# Altium project FM Transmitter.PrjPcb
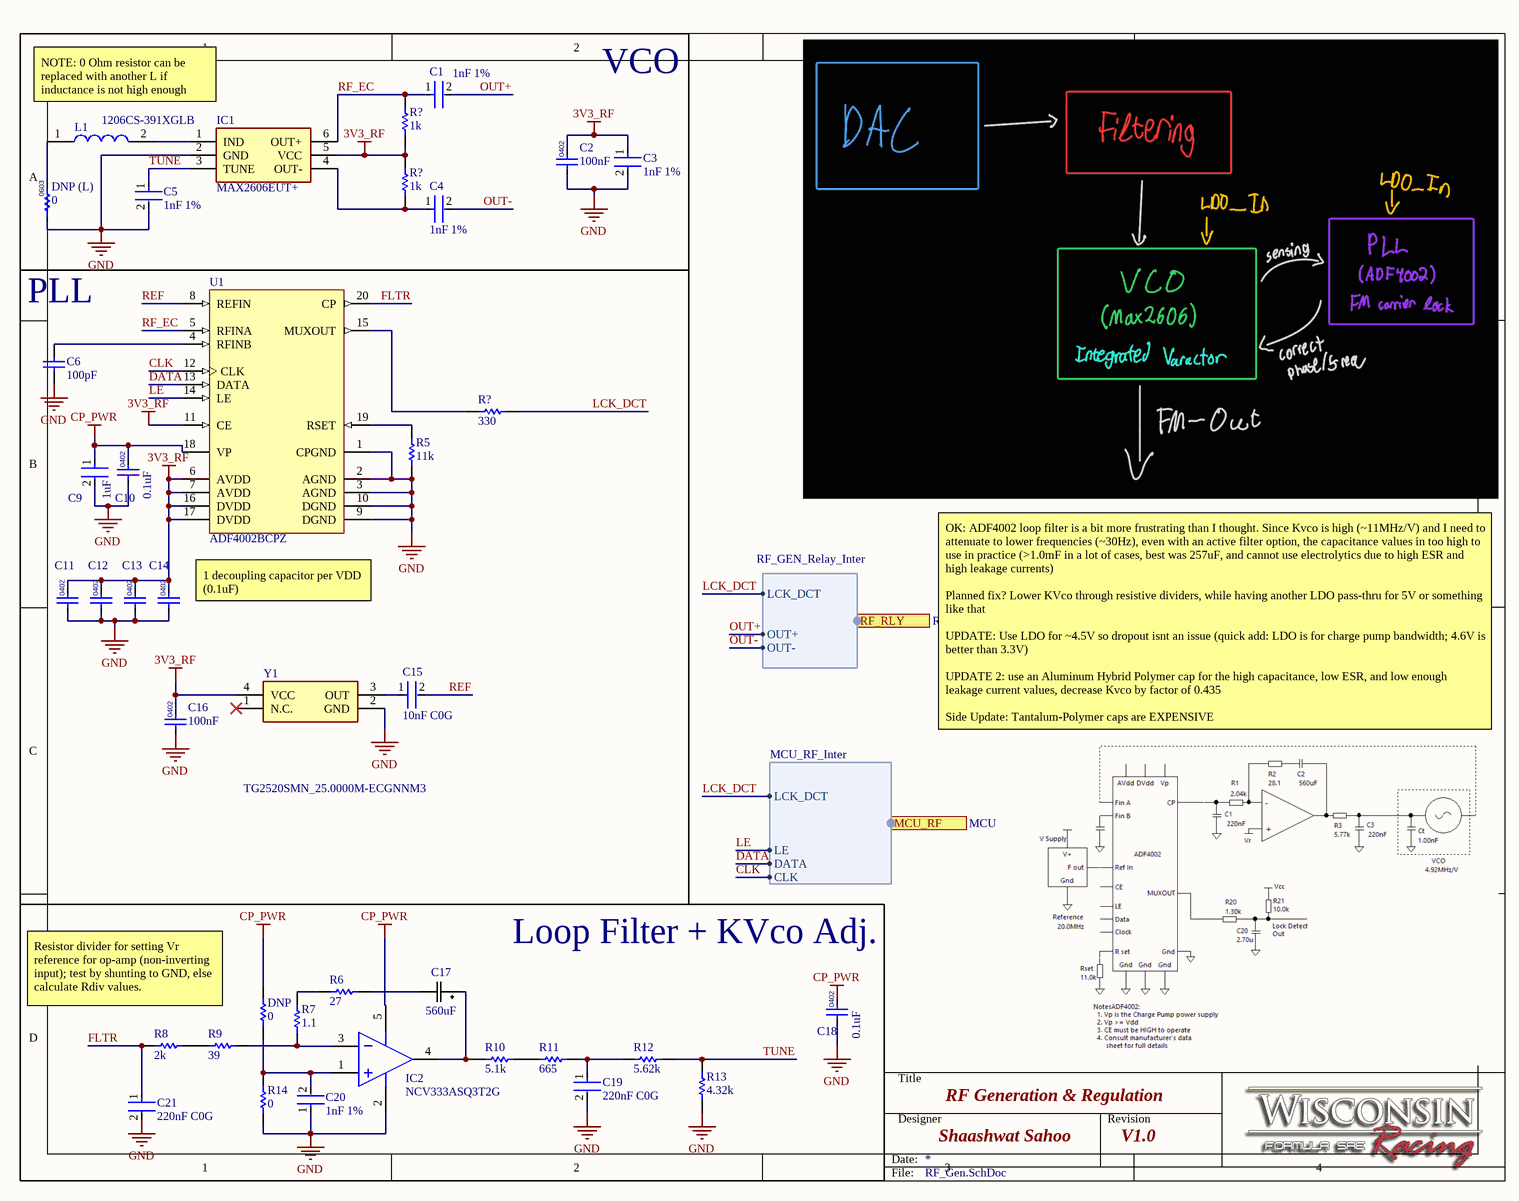
[diagram p0: RF_Gen.SchDoc]
6 sheets, 132 parts. Net scope: flat (ports and power ports of the same name join across sheets).
Sheets:
  RF_Gen.SchDoc
  PDU.SchDoc
  BM83.SchDoc
  DAC.SchDoc
  MCU.SchDoc
  RF_Bypass.SchDoc

## Sheet RF_Gen.SchDoc: RF Generation & Regulation
size 279 x 215 mm; Engineer: Shaashwat Sahoo; Revision: V1.0; SheetNumber: 1; SheetTotal: 6; SPICEModelCacheMXYIGOMC: <root> / <DocumentId>MXYIGOMC</DocumentId> / <CacheFrame Number="0"> / <Model Name="cap" Kind="MDL"> / <Text>*Default semiconductor capacitor / .MODEL CAP C()</Text> / </Model> / </CacheFrame> / </root>

### Parts
(Parts that share a designator on the sheet are numbered #1, #2 ... from top to bottom, then left to right.)
C1  1nF 1%  [FP-GRT155-0_05-IPC_A]
C2  100nF  [FP-CC0402-IPC_B]
C3  1nF 1%  [FP-GRT155-0_05-IPC_A]
C4  1nF 1%  [FP-GRT155-0_05-IPC_A]
C5  1nF 1%  [FP-GRT155-0_05-IPC_A]
C6  100pF  [CAPC1005X55X25ML05T10]
C9  1uF  [FP-GRM155-0_1-IPC_A]
C10  0.1uF  [FP-CC0402-IPC_B]
C11  0.1uF  [FP-CC0402-IPC_B]  (value not drawn)
C12  0.1uF  [FP-CC0402-IPC_B]  (value not drawn)
C13  0.1uF  [FP-CC0402-IPC_B]  (value not drawn)
C14  0.1uF  [FP-CC0402-IPC_B]  (value not drawn)
C15  10nF C0G  [FP-GRM155-0_15-MFG]
C16  100nF  [FP-CC0402-IPC_B]
C17  560uF  [CAP_GY_10X10_NCH]
C18  0.1uF  [FP-CC0402-IPC_B]
C19  220nF C0G  [FP-GRM31C-0_2-e0_3_0_8-IPC_B]
C20  1nF 1%  [FP-GRT155-0_05-IPC_A]
C21  220nF C0G  [FP-GRM31C-0_2-e0_3_0_8-IPC_B]
DNP#1  0  [RESC1005X40X25NL05T10]
DNP_(L)  0  [Res0603-type-2]
IC1  MAX2606EUT+  [SOT95P280X145-6N]
IC2  NCV333ASQ3T2G  [SOT65P210X110-5N]
L1  1206CS-391XGLB  [INDC3622X152N]
R5  11k  [RESC1005X40X25NL05T10]
R6  27  [RESC1005X40X25LL05T10]
R7  1.1  [RESC1005X40X25NL05T10]
R8  2k  [RESC1005X35X25NL10T10]
R9  39  [RESC1005X40X25LL05T10]
R10  5.1k  [RESC1005X40X25NL05T10]
R11  665  [RESC1005X40X25ML05T10]
R12  5.62k  [RESC1005X40X25LL05T10]
R13  4.32k  [RESC1005X40X25NL05T10]
R14  0  [RESC1005X40X25NL05T10]
R?#1  1k  [RESC1005X40X25LL05T10]
R?#2  1k  [RESC1005X40X25LL05T10]
R?#3  330  [RESC1005X40X25LL05T10]
U1  ADF4002BCPZ  [ADI-CP-20-1_M]
Y1  TG2520SMN_25.0000M-ECGNNM3  [TG2520SMN250000MECGNNM3]

### Blocks framed on the sheet
VCO: C1-C5 DNP_(L) IC1 L1 R?#1 R?#2
PLL: C6 C9-C16 R5 R?#3 U1 Y1
Loop Filter + KVco Adj.: C17-C21 DNP#1 IC2 R6-R14

### Ports
MCU_RF (harness MCU_RF_Inter, see MCU), RF_RLY (harness RF_GEN_Relay_Inter, see RF_Bypass)

### Harnesses
MCU_RF_Inter: LCK_DCT, LE, DATA, CLK
RF_GEN_Relay_Inter: LCK_DCT, OUT+, OUT-

### Nets
3V3_RF: C2.2 C3.1 C11.2 C12.2 C13.2 C14.2 C16.2 IC1.5(VCC) R?#1.1 R?#2.2 U1.6(AVDD) U1.7(AVDD) U1.11(CE) U1.16(DVDD) U1.17(DVDD) Y1.4(VCC)
CP_PWR: C9.1 C10.2 C18.2 DNP#1.2 IC2.5(V-) U1.18(VP)
GND: C2.1 C3.2 C5.2 C6.2 C9.2 C10.1 C11.1 C12.1 C13.1 C14.1 C16.1 C18.1 C19.2 C20.1 C21.2 DNP_(L).1 IC1.2(GND) IC2.2(V-) R5.1 R13.1 R14.1 U1.1(CPGND) U1.2(AGND) U1.3(AGND) U1.9(DGND) U1.10(DGND) Y1.2(GND)
CLK: U1.12(CLK) ; port MCU_RF.CLK
DATA: U1.13(DATA) ; port MCU_RF.DATA
FLTR: C21.1 R8.1 U1.20(CP)
LCK_DCT: R?#3.2 ; port MCU_RF.LCK_DCT, port RF_RLY.LCK_DCT
LE: U1.14(LE) ; port MCU_RF.LE
OUT+: C1.2 ; port RF_RLY.OUT+
OUT-: C4.2 ; port RF_RLY.OUT-
REF: C15.2 U1.8(REFIN)
RF_EC: C1.1 IC1.6(OUT+) R?#1.2 U1.5(RFINA)
TUNE: C5.1 IC1.3(TUNE) R12.2 R13.2
NetC4_1: C4.1 IC1.4(OUT-) R?#2.1
NetC6_1: C6.1 U1.4(RFINB)
NetC15_1: C15.1 Y1.3(OUT)
NetC17_1: C17.1 IC2.4(OUT) R10.1
NetC17_2: C17.2 R6.2
NetC19_1: C19.1 R11.2 R12.1
NetC20_2: C20.2 DNP#1.1 IC2.1(IN+) R14.2
NetDNP_(L)_2: DNP_(L).2 L1.1
NetIC1_1: IC1.1(IND) L1.2
NetIC2_3: IC2.3(IN-) R7.1 R9.2
NetR5_2: R5.2 U1.19(RSET)
NetR6_1: R6.1 R7.2
NetR8_2: R8.2 R9.1
NetR10_2: R10.2 R11.1
NetR?#3_1: R?#3.1 U1.15(MUXOUT)

Not connected (* = marked no-connect by the designer): Y1 1(N.C.)*

### Notes on the sheet
- NOTE: 0 Ohm resistor can be replaced with another L if inductance is not high enough
- 1 decoupling capacitor per VDD (0.1uF)
- OK: ADF4002 loop filter is a bit more frustrating than I thought. Since Kvco is high (~11MHz/V) and I need to attenuate to lower frequencies (~30Hz), even with an active filter option, the capacitance values in too high to use in practice (>1.0mF in a lot of cases, best was 257uF, and cannot use electrolytics due to high ESR and high leakage currents)
  Planned fix? Lower KVco through resistive dividers, while having another LDO pass-thru for 5V or something like that
  UPDATE: Use LDO for ~4.5V so dropout isnt an issue (quick add: LDO is for charge pump bandwidth; 4.6V is better than 3.3V)
  UPDATE 2: use an Aluminum Hybrid Polymer cap for the high capacitance, low ESR, and low enough leakage current values, decrease Kvco by factor of 0.435
  Side Update: Tantalum-Polymer caps are EXPENSIVE
- Resistor divider for setting Vr reference for op-amp (non-inverting input); test by shunting to GND, else calculate Rdiv values.
- Title
- Designer
- Revision
- Date:
- File:
- (in symbol CMP-Cap-00006-1) 0402
- (in symbol CMP-Res-00022-2) 0603

### Library data of the parts
C1 C3-C5 C20 = CMP-06035-012909-1: Multi-Layer Ceramic Capacitor 1nF 50V C0G ±1% 0402 Paper T/R / GRT1555C1H102FA02D
C2 C16 = CMP-Cap-00006-1: Ceramic Capacitor, Multilayer, Ceramic, 16V, 10% +Tol, 10% -Tol, X7R, 15% TC, 0.1uF, Surface Mount, 0402; Dielectric: XR7; Tolerance: 10%; Capacitance: 100nF; Voltage Rating: 16V
C6 = CMP-2008-03915-1: Manufacturer: Murata; Part Number: GRM1555C1H101JA01D
C9 = CMP-06035-012596-1: Chip Multilayer Ceramic Capacitors for General Purpose, 0402, 1.0uF, X7R, 15%, 10%, 10V
C10-C14 C18 = CMP-Cap-00006-1: Ceramic Capacitor, Multilayer, Ceramic, 16V, 10% +Tol, 10% -Tol, X7R, 15% TC, 0.1uF, Surface Mount, 0402; Dielectric: XR7; Capacitance: 100nF; Tolerance: 10%; Voltage Rating: 16V
C15 = CMP-06035-053372-1: Chip Multilayer Ceramic Capacitors for General Purpose, 0402, 10000pF, C0G, 30ppm/°C, 5%, 35V
C17 = CMP-034-000012-1: Description; Manufacturer_Name: Nichicon; Copyright: Copyright (C) 2025 Ultra Librarian. All rights reserved.; Design Item ID: GYB1J560MCQ1GS; Manufacturer_Part_Number: GYB1J560MCQ1GS; Source: GYB1J560MCQ1GS.SchLib
C19 C21 = CMP-06035-005862-1: Chip Multilayer Ceramic Capacitors for General Purpose, 1206, 0.22uF, C0G, 30ppm/°C, 5%, 25V
DNP#1 R14 = CMP-1011-00001-2: Manufacturer: Yageo / Phycomp; Part Number: RC0402JR-070RL
DNP_(L) = CMP-Res-00022-2: Fixed Resistor, Metal Glaze/thick Film, 0.1W, 0ohm, Surface Mount, 0603; Tolerance: 0.1%; Power: 100mW; Resistance: 0
IC1 = MAX2606EUT+: Integrated Circuit; Manufacturer_Name: Analog Devices; Datasheet Link: https://datasheets.maximintegrated.com/en/ds/MAX2605-MAX2609.pdf; Height: 1.45mm; Manufacturer_Part_Number: MAX2606EUT+; Mouser Part Number: 700-MAX2606EUT+; Mouser Price/Stock: https://www.mouser.co.uk/ProductDetail/Analog-Devices-Maxim-Integrated/MAX2606EUT%2b?qs=U8%2FOE6X5Fv%2F2oJ3nHVn6vA%3D%3D
IC2 = CMP-006-000098-2: Low Offset Voltage: 10 V max (NCS333); Manufacturer_Name: onsemi; Design Item ID: NCV333ASQ3T2G; Manufacturer_Part_Number: NCV333ASQ3T2G; Source: SamacSys.SchLib; Datasheet Link: https://www.onsemi.com/pub/Collateral/NCS333-D.PDF; Height: 1.1mm; Arrow Part Number: NCV333ASQ3T2G; Arrow Price/Stock: https://www.arrow.com/en/products/ncv333asq3t2g/on-semiconductor?region=nac; Mouser Part Number: 863-NCV333ASQ3T2G; Mouser Price/Stock: https://www.mouser.co.uk/ProductDetail/onsemi/NCV333ASQ3T2G?qs=f9yNj16SXrKU9Ty3EUv2qA%3D%3D
L1 = 1206CS-391XGLB: Inductor; Manufacturer_Name: COILCRAFT; Datasheet Link: https://componentsearchengine.com/Datasheets/2/1206CS-391XGLB.pdf; Height: 1.52mm; Manufacturer_Part_Number: 1206CS-391XGLB
R5 R10 = CMP-2002-07753-1: Part Number: RC0402FR-075K1L; Manufacturer: Yageo / Phycomp
R6 = CMP-2002-07055-1: Part Number: RC0402FR-0727RL; Manufacturer: Yageo / Phycomp
R7 = CMP-1011-00175-2: Part Number: RC0402FR-071R1L; Manufacturer: Yageo / Phycomp
R8 = CMP-2002-02941-1: Manufacturer: Yageo; Part Number: RT0402BRD072KL
R9 = CMP-1011-00350-2: Manufacturer: Yageo / Phycomp; Part Number: RC0402FR-0739RL
R11 = CMP-2002-07113-1: Part Number: RC0402FR-07665RL; Manufacturer: Yageo / Phycomp
R12 = CMP-2002-07755-1: Part Number: RC0402FR-075K62L; Manufacturer: Yageo / Phycomp
R13 = CMP-1011-00582-2: Part Number: RC0402FR-074K32L; Manufacturer: Yageo / Phycomp
R?#1 R?#2 = CMP-2002-07941-1: Part Number: RC0402JR-071KL; Manufacturer: Yageo / Phycomp
R?#3 = CMP-2002-07613-1: Part Number: RC0402FR-07330RL; Manufacturer: Yageo / Phycomp
U1 = CMP-0287-00012-1: Phase Detector/Frequency Synthesizer, CP-20-1, Pb-Free, 490 Tray; Max REFin (MHz): 300MHz; Supply Current: 5mA; Norm Phase Noise (dBc/Hz): -222dBc; Max RF Input (MHz): 400MHz; Frequency Range: 5MHz-400MHz; Single/Dual: Single; PackageReference: CP-20-1; Code_JEDEC: MO-220-VGGD-1; ComponentLink1URL: www.analog.com; ComponentLink3Description: Package Specification; PackageVersion: 012508-B; DatasheetVersion: Rev. B; ComponentLink3URL: http://www.analog.com/static/imported-files/packages/PKG_PDF/LFCSP(CP)/CP_20_1.pdf; ComponentLink2Description: Datasheet; ComponentLink1Description: Manufacturer URL; PackageDescription: 20-Lead Lead Frame Chip Scale Package [LFCSP_VQ]; ComponentLink2URL: http://www.analog.com/static/imported-files/data_sheets/ADF4002.pdf
Y1 = TG2520SMN_25.0000M-ECGNNM3: Crystal or Oscillator; Manufacturer_Name: Epson Timing; Manufacturer_Part_Number: TG2520SMN 25.0000M-ECGNNM3; Datasheet Link: https://au.mouser.com/datasheet/2/137/Epson_TG2016SMN_en_1649545-1889946.pdf; Height: 0.8mm; Mouser Part Number: 732-TG252S25ECGNNM3; Mouser Price/Stock: https://www.mouser.co.uk/ProductDetail/Epson-Timing/TG2520SMN-25.0000M-ECGNNM3?qs=d0WKAl%252BL4KZiXJ1i3MlmDQ%3D%3D

## Sheet PDU.SchDoc
size 279 x 215 mm; SheetNumber: 2; SheetTotal: 5
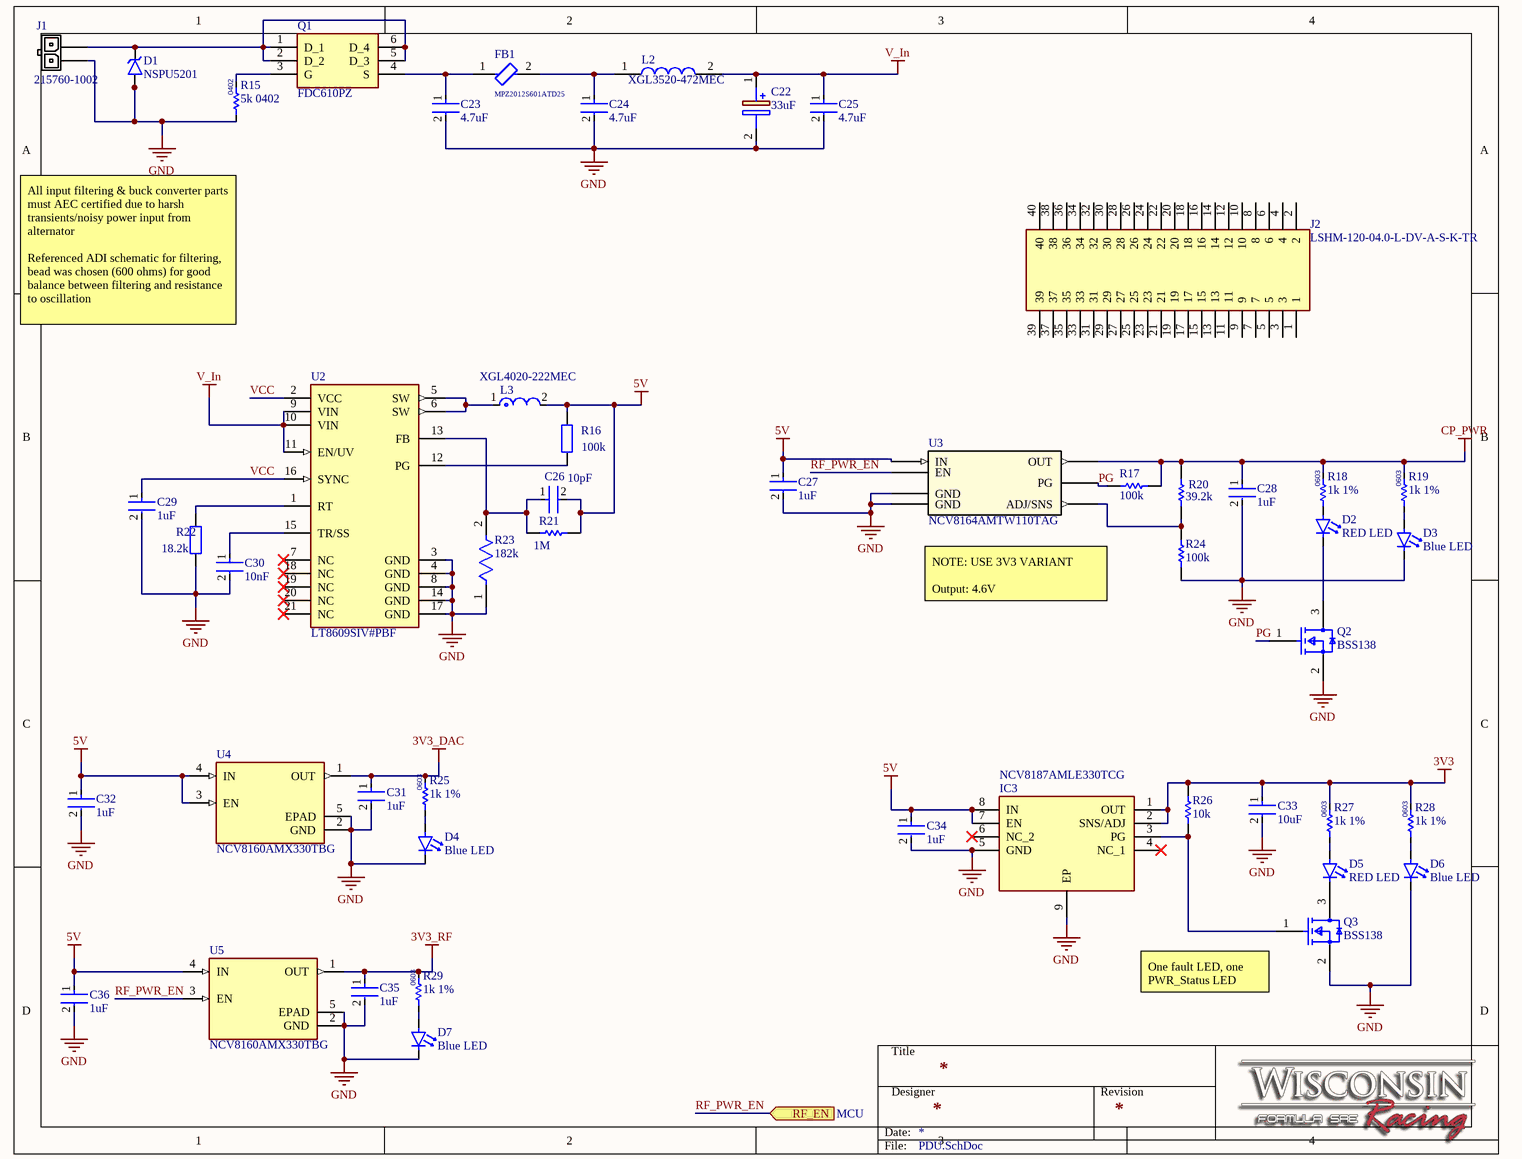
[diagram p1: PDU.SchDoc]

### Parts
C22  33uF  [MAL215097904E3]
C23  4.7uF  [FP-CGA4J-IPC_C]
C24  4.7uF  [FP-CGA4J-IPC_C]
C25  4.7uF  [FP-CGA4J-IPC_C]
C26  10pF  [FP-GCM155-0_05-IPC_C]
C27  1uF  [FP-GRM155-0_1-IPC_C]
C28  1uF  [FP-GRM155-0_1-IPC_C]
C29  1uF  [FP-GRT155-0_1-IPC_A]
C30  10nF  [FP-GCM155-0_05-IPC_C]
C31  1uF  [FP-GRM155-0_1-IPC_C]
C32  1uF  [FP-GRM155-0_1-IPC_C]
C33  10uF  [FP-GRM155-0_2-IPC_A]
C34  1uF  [FP-GRM155-0_1-IPC_C]
C35  1uF  [FP-GRM155-0_1-IPC_C]
C36  1uF  [FP-GRM155-0_1-IPC_C]
D1  NSPU5201  [NSPM5131MUTBG]
D2  RED LED  [DIOC1608X05N]
D3  Blue LED  [0603-LED-1]
D4  Blue LED  [0603-LED-1]
D5  RED LED  [DIOC1608X05N]
D6  Blue LED  [0603-LED-1]
D7  Blue LED  [0603-LED-1]
FB1  MPZ2012S601ATD25  [BEADC2012X105N]
IC3  NCV8187AMLE330TCG  [SON65P300X300X100-9N-D]
J1  215760-1002  [215760-1002-Footprint-1]
J2  LSHM-120-04.0-L-DV-A-S-K-TR  [LSHM-120-XX.X-YYY-DV-A-S-K-TR]
L2  XGL3520-472MEC  [XGL3520472MEC]
L3  XGL4020-222MEC  [FP-XGL4020-MFG]
Q1  FDC610PZ  [SOT95P280X110-6N]
Q2  BSS138  [FP-318-08-IPC_B]
Q3  BSS138  [FP-318-08-IPC_B]
R15  5k 0402  [Res0402-Type-1]
R16  100k  [WRIS-RSKS_0402]
R17  100k  [RESC1005X40X25NL05T10]
R18  1k 1%  [Res0603-type-1]
R19  1k 1%  [Res0603-type-1]
R20  39.2k  [RESC1005X40X25ML05T10]
R21  1M  [RESC1005X40X25NL05T10]
R22  18.2k  [WRIS-RSKS_0402]
R23  182k  [FP-AC0402-IPC_C]
R24  100k  [RESC1005X40X25NL05T10]
R25  1k 1%  [Res0603-type-1]
R26  10k  [RESC1005X40X25ML05T05]
R27  1k 1%  [Res0603-type-1]
R28  1k 1%  [Res0603-type-1]
R29  1k 1%  [Res0603-type-1]
U2  LT8609SIV#PBF  [FP-LQFN-16-05-08-1516-MFG]
U3  NCV8164AMTW110TAG  [WDFNW6_511DW_OSI]
U4  NCV8160AMX330TBG  [VREG_NCV8160AMX330TBG]
U5  NCV8160AMX330TBG  [VREG_NCV8160AMX330TBG]

### Ports
RF_EN (in, see MCU)

### Nets
3V3: C33.1 IC3.1(OUT) IC3.2(SNS/ADJ) R26.2 R27.2 R28.2
3V3_DAC: C31.1 R25.2 U4.1(OUT)
3V3_RF: C35.1 R29.2 U5.1(OUT)
5V: C26.2 C27.1 C32.1 C34.1 C36.1 IC3.7(EN) IC3.8(IN) L3.2 R16.2 R21.2 U3.6(IN) U4.3(EN) U4.4(IN) U5.4(IN)
CP_PWR: C28.1 R17.1 R18.2 R19.2 R20.2 U3.1(OUT)
GND: C22.2(-) C23.2 C24.2 C25.2 C27.2 C28.2 C29.2 C30.2 C31.2 C32.2 C33.2 C34.2 C35.2 C36.2 D1.5(GND_(A)_1) D1.6(GND_(A)_2) D1.7(GND_(A)_3) D1.8(GND_(A)_4) D3.1(C) D4.1(C) D6.1(C) D7.1(C) IC3.5(GND) IC3.9(EP) J1.2 Q2.2(S) Q3.2(S) R15.1 R22.1 R23.1 R24.1 U2.3(GND) U2.4(GND) U2.8(GND) U2.14(GND) U2.17(GND) U3.5(GND) U3.7(GND) U4.2(GND) U4.5(EPAD) U5.2(GND) U5.5(EPAD)
V_In: C22.1(+) C25.1 L2.2 U2.9(VIN) U2.10(VIN) U2.11(EN/UV)
PG: Q2.1(G) R17.2 U3.3(PG)
RF_PWR_EN: U3.4(EN) U5.3(EN) ; port RF_EN
VCC: C29.1 U2.2(VCC) U2.16(SYNC)
NetC23_1: C23.1 FB1.1 Q1.4(S)
NetC24_1: C24.1 FB1.2 L2.1
NetC26_1: C26.1 R21.1 R23.2 U2.13(FB)
NetC30_1: C30.1 U2.15(TR/SS)
NetD1_1: D1.1 D1.2 J1.1 Q1.1(D_1) Q1.2(D_2) Q1.5(D_3) Q1.6(D_4)
NetD2_1: D2.1(C) Q2.3(D)
NetD3_2: D3.2(A) R19.1
NetD4_2: D4.2(A) R25.1
NetD5_1: D5.1(C) Q3.3(D)
NetD5_2: D5.2(A) R27.1
NetD6_2: D6.2(A) R28.1
NetD7_2: D7.2(A) R29.1
NetIC3_3: IC3.3(PG) Q3.1(G) R26.1
NetL3_1: L3.1 U2.5(SW) U2.6(SW)
NetQ1_3: Q1.3(G) R15.2
NetR16_1: R16.1 U2.12(PG)
NetR20_1: R20.1 R24.2 U3.2(ADJ/SNS)
NetR22_2: R22.2 U2.1(RT)

Not connected (* = marked no-connect by the designer): D2 2(A); IC3 4(NC_1)* 6(NC_2)*; J2 1 2 3 4 5 6 7 8 9 10 11 12 13 14 15 16 17 18 19 20 21 22 23 24 25 26 27 28 29 30 31 32 33 34 35 36 37 38 39 40; R18 1; U2 7(NC)* 18(NC)* 19(NC)* 20(NC)* 21(NC)*

### Notes on the sheet
- All input filtering & buck converter parts must AEC certified due to harsh transients/noisy power input from alternator
  Referenced ADI schematic for filtering, bead was chosen (600 ohms) for good balance between filtering and resistance to oscillation
- NOTE: USE 3V3 VARIANT
  Output: 4.6V
- (near Q3) One fault LED, one PWR_Status LED
- Title
- Designer
- Revision
- Date:
- File:
- (in symbol CMP-005-000017-1) 0603
- (in symbol CMP-Res-00031-1) 0402

### Library data of the parts
C22 = MAL215097904E3: Capacitor Polarised / MAL215097904E3; Manufacturer_Name: Vishay; Datasheet Link: https://www.vishay.com/docs/28395/150crz.pdf; Height: 10.5mm; Manufacturer_Part_Number: MAL215097904E3; Mouser Part Number: 594-MAL215097904E3; Mouser Price/Stock: https://www.mouser.co.uk/ProductDetail/Vishay-BC-Components/MAL215097904E3?qs=LPi%252B6n6Uj5NKbv7W8MBx6Q%3D%3D; Arrow Part Number: MAL215097904E3; Arrow Price/Stock: https://www.arrow.com/en/products/mal215097904e3/vishay?region=nac
C23-C25 = CMP-08246-000171-1: Cap Ceramic 4.7uF 50V X7R 10% Pad SMD 0805 +125°C Automotive T/R
C26 = CMP-06035-039712-1: Ceramic Capacitor for Automotive 10pF ±5% 50VDC C0G 0402 Paper T/R; Voltage Rating: 50V; Case/Package: 0402; Dielectric: C0G; Package Quantity: 10000; Ratings: AEC-Q200; Max Operating Temperature: 125°C; Width: 0.02inch; REACH SVHC: No SVHC; Mount: Surface Mount; Min Operating Temperature: -55°C; Lead Free: Lead Free; Packaging: Tape and Reel; Capacitance: 10pF; Case Code (Imperial): 0402; Tolerance: 5%; Height: 0.5mm; Thickness: 0.022inch; Length: 0.039inch; Case Code (Metric): 1005; Weight: 0.000212oz; Voltage Rating (DC): 50V; Termination: SMD/SMT
C27 C28 C31 C32 C34-C36 = CMP-06035-028020-1: Chip Multilayer Ceramic Capacitors for General Purpose, 0402, 1.0uF, X7R, 15%, 10%, 10V / GRM155Z71A105KE01D
C29 = CMP-06035-047663-1: Multi-Layer Ceramic Capacitor 1uF 25V X6S ±10% 0402 Paper T/R / GRT155C81E105KE13D
C30 = CMP-2008-03723-3: Ceramic Capacitor for Automotive 10nF ±10% 50VDC X7R 0402 Paper T/R / GCM155R71H103KA55D; Voltage Rating (DC): 50V; Min Operating Temperature: -55°C; Radiation Hardening: No; Mount: Surface Mount; Thickness: 0.022inch; Package Quantity: 1; Case Code (Imperial): 0402; Lead Free: Lead Free; Case/Package: 0402; Depth: 0.5mm; Termination: SMD/SMT; Tolerance: 10%; Voltage: 50V; Packaging: Tape and Reel; Width: 0.02inch; REACH SVHC: No SVHC; Height: 0.5mm; Max Operating Temperature: 125°C; Case Code (Metric): 1005; Voltage Rating: 50V; Capacitance: 10nF; Ratings: AEC-Q200; Length: 1mm; Dielectric: X7R
C33 = CMP-06035-061139-1: Chip Multilayer Ceramic Capacitors for General Purpose, 0402, 10uF, X5R, 15%, 20%, 6.3V
D1 = CMP-004-000061-2: Unidirectional High Voltage ESD and Surge Protection; Provides ESD Protection to IEC6100042 Level 4: +/-30 kV Contact Discharge; Small Package: 1.8 mm x 2.0 mm; These Devices are PbFree; Manufacturer_Name: onsemi; Arrow Part Number: NSPU5201MUTBG; Design Item ID: NSPU5201MUTBG; Source: SamacSys.SchLib; Mouser Price/Stock: https://www.mouser.co.uk/ProductDetail/ON-Semiconductor/NSPU5201MUTBG?qs=byeeYqUIh0OtIrNH4%2Fsnzg%3D%3D; Mouser Part Number: 863-NSPU5201MUTBG; Height: 0mm; Datasheet Link: https://www.onsemi.com/pub/Collateral/NSPU5201-D.PDF; Manufacturer_Part_Number: NSPU5201MUTBG; Arrow Price/Stock: https://www.arrow.com/en/products/nspu5201mutbg/on-semiconductor
D2 D5 = CMP-221-0013-1: 0603 Red SMD Led; Datasheet: https://www.aopled.com/AOP_PDFs/L196L-LIC.pdf
D3 D4 D6 D7 = CMP-LED-0000-10: Single Color LED, Blue, Water Clear, 1.1mm; Lens Color: Colorless; Wavelength: 468nm; Luminous Intensity: 180mcd; Number of Elements: 1; Power Dissipation: 76mW; Max Power Dissipation: 75mW; Forward Current: 20mA; Forward Voltage: 3.8V; Lens Style: Diffused,Colorless,Clear,Rectangular; Dominant Wavelength: 475nm; Viewing Angle: 130°; Reverse Voltage: 5V; Length: 0.8mm; Max Operating Temperature: 80°C; Height: 0.55mm; Mount: Surface Mount; Number of Pins: 2; Lens Transparency: Clear; Color: Blue; Radiation Hardening: No; Illumination Color: Blue; Depth: 1.6mm; Packaging: Tape and Reel; Case Code (Imperial): 0603; Number of LEDs: 1; Lead Free: Lead Free; Case Code (Metric): 1608; Width: 0.8mm; Min Operating Temperature: -20°C; Case/Package: 0603; Package Quantity: 1; Test Current: 20mA
FB1 = CMP-002-000016-2: Ferrite Beads Multi-Layer Power 600Ohm 25% 100MHz 2A 100mOhm DCR 0805 Automotive T/R; Manufacturer_Name: TDK; Arrow Part Number: MPZ2012S601ATD25; Datasheet Link: https://product.tdk.com/system/files/dam/doc/product/emc/emc/beads/catalog/beads_automotive_power_mpz2012_en.pdf; Manufacturer_Part_Number: MPZ2012S601ATD25; Design Item ID: MPZ2012S601ATD25; Height: 1.05mm; Mouser Price/Stock: https://www.mouser.co.uk/ProductDetail/TDK/MPZ2012S601ATD25?qs=n0%2F4YYxsltT7vo9AjVUU7w%3D%3D; Mouser Part Number: 810-MPZ2012S601ATD25; Source: SamacSys.SchLib; Arrow Price/Stock: https://www.arrow.com/en/products/mpz2012s601atd25/tdk.html?utm_currency=USD&region=europe
IC3 = NCV8187AMLE330TCG: Integrated Circuit; Manufacturer_Name: onsemi; Datasheet Link: https://www.onsemi.com/pub/Collateral/NCV8187-D.PDF; Height: 1mm; Manufacturer_Part_Number: NCV8187AMLE330TCG; Mouser Part Number: 863-CV8187AMLE330TCG; Mouser Price/Stock: https://www.mouser.co.uk/ProductDetail/onsemi/NCV8187AMLE330TCG?qs=HBWAp0VN4RhK8HbhfCLXcQ%3D%3D; Arrow Part Number: NCV8187AMLE330TCG; Arrow Price/Stock: https://www.arrow.com/en/products/ncv8187amle330tcg/on-semiconductor?region=nac
J1 = CMP-007-000050-6: Micro-Fit+ Right-Angle Header, 3.00mm Pitch, Single Row, 2 Circuits, Matte Tin (Sn) Plating, UL 94V-0, Glow-Wire Capable, Black; Manufacturer 1: Molex; Number of Contacts: 2; Manufacturer Part Number 1: 215760-1002; Number of Rows: 1
J2 = LSHM-120-04.0-L-DV-A-S-K-TR: Connector; Manufacturer_Name: SAMTEC; Datasheet Link: http://suddendocs.samtec.com/prints/lshm-1xx-xx.x-xxx-dv-a-x-x-xx-mkt.pdf; Manufacturer_Part_Number: LSHM-120-04.0-L-DV-A-S-K-TR; Mouser Part Number: 200-LSHM12004LDVASK; Mouser Price/Stock: https://www.mouser.co.uk/ProductDetail/Samtec/LSHM-120-040-L-DV-A-S-K-TR?qs=PB6%2FjmICvI1v5WBlLc04lg%3D%3D; Arrow Part Number: LSHM-120-04.0-L-DV-A-S-K-TR; Arrow Price/Stock: https://www.arrow.com/en/products/lshm-120-04.0-l-dv-a-sktr/samtec?region=nac
L2 = XGL3520-472MEC: Inductor; Manufacturer_Name: COILCRAFT; Datasheet Link: https://www.coilcraft.com/getmedia/d18b8771-c466-42ab-98b9-5b7a3721ea57/xgl3520.pdf?srsltid=AfmBOoq9-uDh3EmdFKVY7cd9_AL22AmMmwAAQ9UBadXdflM2b3sgRKIR; Height: 2mm; Manufacturer_Part_Number: XGL3520-472MEC
L3 = CMP-11268-000045-2: Shielded Power Inductors
Q1 = FDC610PZ: MOSFET (P-Channel); Manufacturer_Name: onsemi; Datasheet Link: https://www.onsemi.com/pub/Collateral/FDC610PZ-D.PDF; Height: 1.1mm; Manufacturer_Part_Number: FDC610PZ; Mouser Part Number: 512-FDC610PZ; Mouser Price/Stock: https://www.mouser.co.uk/ProductDetail/onsemi-Fairchild/FDC610PZ?qs=6olcXJbp99R1vIAdhgXLVw%3D%3D; Arrow Part Number: FDC610PZ; Arrow Price/Stock: https://www.arrow.com/en/products/fdc610pz/on-semiconductor
Q2 Q3 = CMP-07173-000101-1: MOSFET N-CH 50V 220MA SOT-23; Turn-Off Delay Time: 20ns; Element Configuration: Single; Rds On Max: 3.5R; Gate to Source Voltage (Vgs): 20V; Threshold Voltage: 1.3V; Number of Elements: 1; Power Dissipation: 360mW; Rise Time: 9ns; Turn-On Delay Time: 2.5ns; Input Capacitance: 27pF; On-State Resistance: 6R; Lead Free: Lead Free; Length: 2.92mm; Width: 1.3mm; Drain to Source Breakdown Voltage: 50V; Min Operating Temperature: -55°C; REACH SVHC: No SVHC; Packaging: Tape and Reel; Radiation Hardening: No; Height: 0.93mm; Drain to Source Voltage (Vdss): 50V; Current Rating: 220mA; Voltage Rating (DC): 50V; Weight: 0.03g; Continuous Drain Current (ID): 220mA; Number of Pins: 3; Nominal Vgs: 1.3V; Max Power Dissipation: 360mW; Fall Time: 9ns; Drain to Source Resistance: 3.5R; Contact Plating: Tin; Case/Package: SOT-23; Package Quantity: 1; Dual Supply Voltage: 50V; Mount: Surface Mount; Termination: SMD/SMT; Max Operating Temperature: 150°C
R15 = CMP-Res-00031-1: Fixed Resistor, Metal Glaze/thick Film, 0.0625W, 5000ohm, 50V, 1% +/-Tol, 100ppm/Cel, Surface Mount, 0402; Power: 63mW; Resistance: 5k; Tolerance: 1%
R16 = CMP-03913-145532703-2: Resistor, 100K, 0.1W, Thick Film, 0402 Rohs Compliant: Yes; Manufacturer Lifecycle Status: ACTIVE; Resistance: 100kΩ; YEOL: 1 = Estimated lifetime > 10 years; Width: 500µm; Min Operating Temperature: -55°C; Height: 350µm; Length: 1mm; Lifecycle Status: Production; Max Operating Temperature: 155°C; RoHS: Compliant
R17 R24 = CMP-2002-07343-1: Part Number: RC0402FR-07100KL; Manufacturer: Yageo / Phycomp
R18 R19 R25 R27-R29 = CMP-005-000017-1: Fixed Resistor, Metal Glaze/thick Film, 0.1W, 1000ohm, 75V, 1% +/-Tol, 100ppm/Cel, Surface Mount, 0603; Min Operating Temperature: -55°C; Mount: Surface Mount; Packaging: Tape and Reel; Max Operating Temperature: 155°C
R20 = CMP-2002-07644-1: Part Number: RC0402FR-0739K2L; Manufacturer: Yageo
R21 = CMP-2002-07490-1: Manufacturer: Yageo / Phycomp; Part Number: RC0402FR-071ML
R22 = CMP-03913-145532814-2: Resistor, 18K2, 0.1W, Thick Film, 0402 Rohs Compliant: Yes; Manufacturer Lifecycle Status: ACTIVE; YEOL: 1 = Estimated lifetime > 10 years; Resistance: 18.2kΩ; Min Operating Temperature: -55°C; Height: 350µm; RoHS: Compliant; Lifecycle Status: Production; Width: 500µm; Length: 1mm; Max Operating Temperature: 155°C
R23 = CMP-03412-035751-2: RES 182kΩ ±1% 0.063W 0402; Max Power Dissipation: 63mW; Resistance: 182kR; Power Rating: 62.5mW; Temperature Coefficient: 100ppm/°C; Voltage Rating: 50V; Number of Terminations: 2; Tolerance: 1%; Case/Package: 0402; Min Operating Temperature: -55°C; Length: 0.039inch; Packaging: Tape and Reel; Case Code (Metric): 1005; Termination: SMD/SMT; Width: 0.5mm; RoHS Compliant: Yes; Resistor Type: Thick Film; Height: 0.015inch; Max Operating Temperature: 155°C; Series: AC; Case Code (Imperial): 0402; Weight: 2.3E-05oz; Features: Moisture Resistant
R26 = CMP-2002-00433-1: Part Number: ERJ-2GEJ103X; Manufacturer: Panasonic
U2 = CMP-09139-000009-1: IC REG BUCK ADJUSTABLE 2A 16LQFN; Manufacturer: Analog Devices; Standoff Height: 0.01mm; Nominal Supply Current: 1-1.7uA; Min Supply Voltage: 3V; Max Duty Cycle: 100%; Output Type: AdjustableProgrammable; Max Junction Temp: +125°C; Switching Frequency: 200-2200kHz; Max Supply Voltage: 42V; Number Of Outputs: 1; Digikey Description: IC REG BUCK ADJUSTABLE 2A 16LQFN; Octopart: https://octopart.com/lt8609siv%23pbf-analog+devices-88316701; Automotive: No; Package: LQFN-16-05-08-1516; Temperature Range High: +125°C; Category: IC; Temperature Range Low: -40°C; ComponentLink2Description: Datasheet; Output Current: 2A; Mouser Description: LT8609S - 42V, 2A/3A Peak Synchronous Step-Down Regulator with 2.5µA Quiescent Current; Temperature: -40°C to +125°C; ComponentLink2URL: https://www.analog.com/media/en/technical-documentation/data-sheets/LT8609S.pdf; RoHS: TRUE; Device Class L2: Power Management ICs; Device Class L3: Voltage Regulators - Switching; Height: 1.03mm; Device Class L1: Integrated Circuits (ICs); Switching Topology: Buck; Lead Free: Yes; Manufacturer Part Number: LT8609SIV#PBF
U3 = CMP-196-000000-3: LDO; Manufacturer_Name: onsemi; Source: NCV8164AMTW110TAG.SchLib; RefDes: RefDes; Design Item ID: NCV8164AMTW110TAG; Copyright: Copyright (C) 2025 Ultra Librarian. All rights reserved.; Manufacturer_Part_Number: NCV8164AMTW110TAG; Type: Power Management
U4 U5 = CMP-006-000097-1: Linear Voltage Regulator IC Positive Fixed 1 Output 250mA 4-XDFN (1x1); MF: ON Semiconductor; Design Item ID: NCV8160AMX330TBG; SnapEDA_Link: https://www.snapeda.com/parts/NCV8160AMX330TBG/Onsemi/view-part/?ref=snap; Pin Count: 5; Check_prices: https://www.snapeda.com/parts/NCV8160AMX330TBG/Onsemi/view-part/?ref=eda; Value: *; MP: NCV8160AMX330TBG; Source: NCV8160AMX330TBG.SchLib; Component Type: Standard; Package: XDFN-4 ON Semiconductor

## Sheet BM83.SchDoc
size 279 x 215 mm; SheetNumber: 3; SheetTotal: 4; SPICEModelCacheLVVEWYVA: <root> / <DocumentId>LVVEWYVA</DocumentId> / <CacheFrame Number="0"> / <Model Name="cap" Kind="MDL"> / <Text>*Default semiconductor capacitor / .MODEL CAP C()</Text> / </Model> / </CacheFrame> / </root>
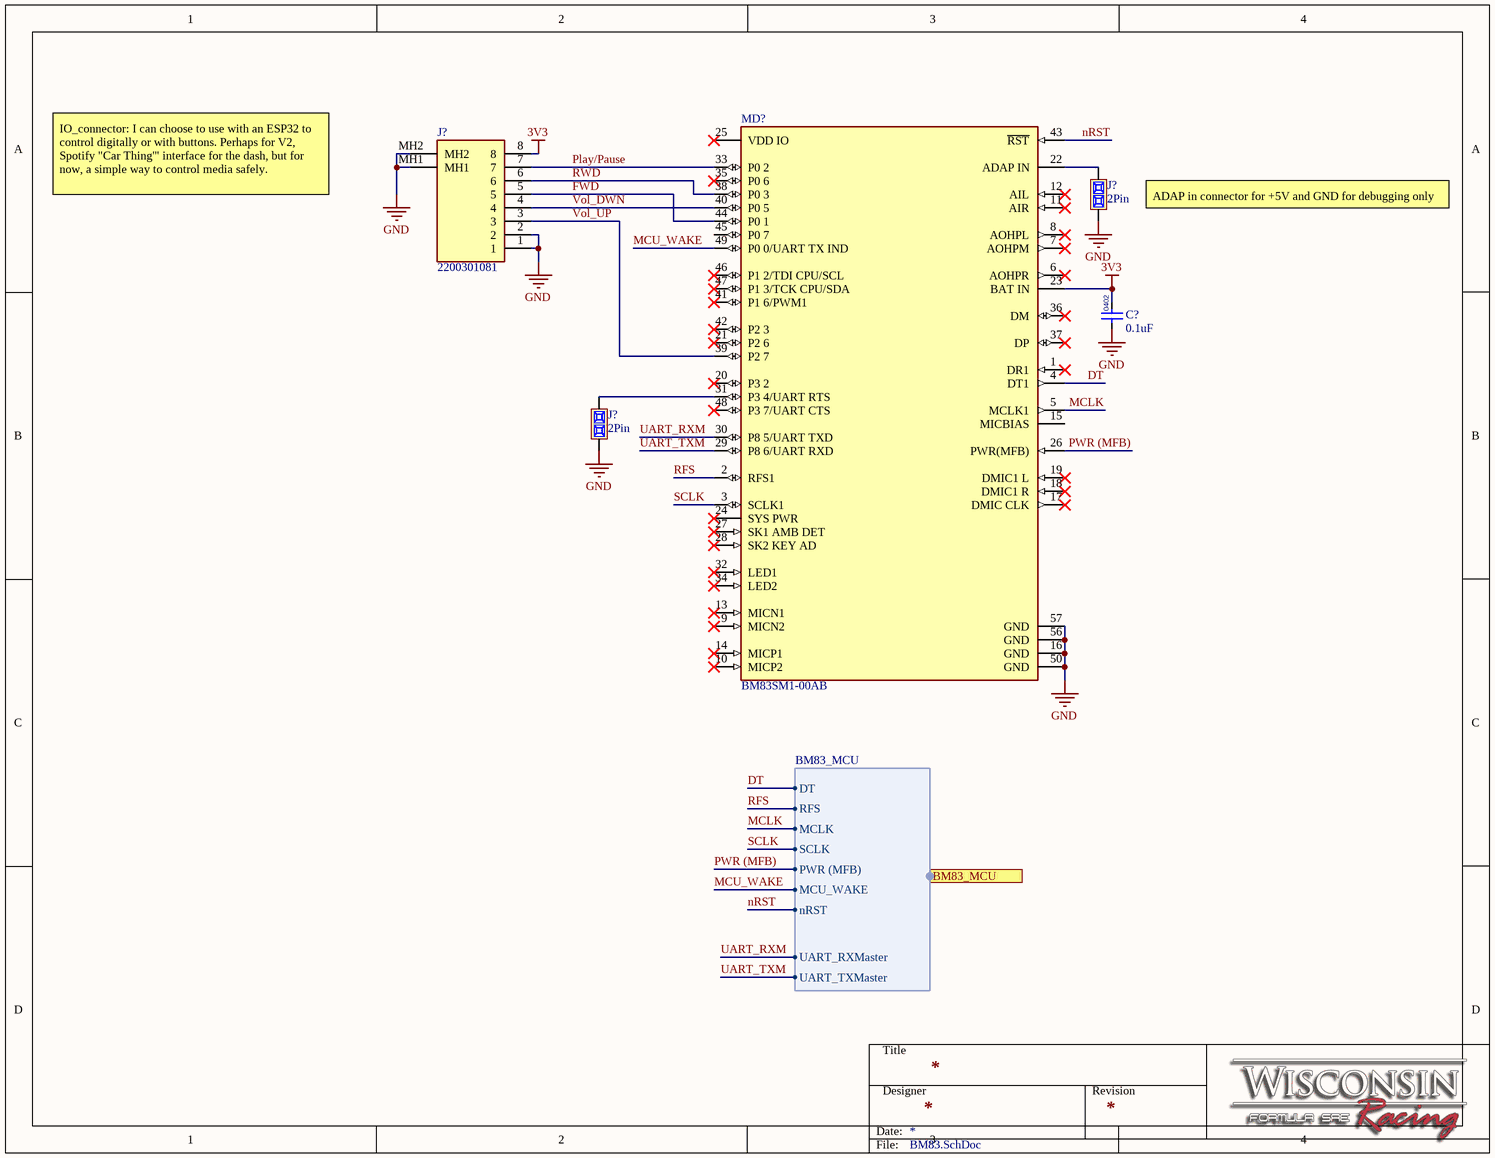
[diagram p2: BM83.SchDoc]

### Parts
(Parts that share a designator on the sheet are numbered #1, #2 ... from top to bottom, then left to right.)
C?#1  0.1uF  [FP-CC0402-IPC_B]
J?#1  2200301081  [2200301081]
J?#2  2Pin  [2 Pin Male]
J?#3  2Pin  [2 Pin Male]
MD?  BM83SM1-00AB  [FP-BM83SM1-00AB-MFG]

### Ports
BM83_MCU (harness BM83_MCU)

### Harnesses
BM83_MCU: MCLK, MCU_WAKE, SCLK, PWR (MFB), RFS, DT, nRST, UART_TXMaster, UART_RXMaster

### Nets
3V3: C?#1.2 J?#1.8 MD?.23(BAT_IN)
GND: C?#1.1 J?#1.1 J?#1.2 J?#1.MH1 J?#1.MH2 J?#2.1 J?#3.1 MD?.16(GND) MD?.50(GND) MD?.56(GND) MD?.57(GND)
DT: MD?.4(DT1) ; port BM83_MCU.DT
FWD: J?#1.5 MD?.44(P0_1)
MCLK: MD?.5(MCLK1) ; port BM83_MCU.MCLK
MCU_WAKE: MD?.49(P0_0/UART_TX_IND) ; port BM83_MCU.MCU_WAKE
nRST: MD?.43(~{RST}) ; port BM83_MCU.nRST
Play/Pause: J?#1.7 MD?.33(P0_2)
PWR (MFB): MD?.26(PWR(MFB)) ; port BM83_MCU.PWR (MFB)
RFS: MD?.2(RFS1) ; port BM83_MCU.RFS
RWD: J?#1.6 MD?.38(P0_3)
SCLK: MD?.3(SCLK1) ; port BM83_MCU.SCLK
UART_RXM: MD?.30(P8_5/UART_TXD) ; port BM83_MCU.UART_RXMaster
UART_TXM: MD?.29(P8_6/UART_RXD) ; port BM83_MCU.UART_TXMaster
Vol_DWN: J?#1.4 MD?.40(P0_5)
Vol_UP: J?#1.3 MD?.39(P2_7)
NetJ?#2_2: J?#2.2 MD?.22(ADAP_IN)
NetJ?#3_2: J?#3.2 MD?.31(P3_4/UART_RTS)

Not connected (* = marked no-connect by the designer): MD? 1(DR1)* 6(AOHPR)* 7(AOHPM)* 8(AOHPL)* 9(MICN2)* 10(MICP2)* 11(AIR)* 12(AIL)* 13(MICN1)* 14(MICP1)* 15(MICBIAS) 17(DMIC_CLK)* 18(DMIC1_R)* 19(DMIC1_L)* 20(P3_2)* 21(P2_6)* 24(SYS_PWR)* 25(VDD_IO)* 27(SK1_AMB_DET)* 28(SK2_KEY_AD)* 32(LED1)* 34(LED2)* 35(P0_6)* 36(DM)* 37(DP)* 41(P1_6/PWM1)* 42(P2_3)* 45(P0_7) 46(P1_2/TDI_CPU/SCL)* 47(P1_3/TCK_CPU/SDA)* 48(P3_7/UART_CTS)*

### Notes on the sheet
- IO_connector: I can choose to use with an ESP32 to control digitally or with buttons. Perhaps for V2, Spotify "Car Thing'" interface for the dash, but for now, a simple way to control media safely.
- (near J?#2) ADAP in connector for +5V and GND for debugging only
- Title
- Designer
- Revision
- Date:
- File:
- (in symbol CMP-Cap-00006-1) 0402

### Library data of the parts
C?#1 = CMP-Cap-00006-1: as C10 on sheet RF_Gen; Tolerance: 10%; Voltage Rating: 16V
J?#1 = 2200301081: Connector; Manufacturer_Name: Molex; Datasheet Link: https://www.molex.com/en-us/products/part-detail-pdf/2200301081?display=pdf; Height: 7.3mm; Manufacturer_Part_Number: 2200301081
J?#2 J?#3 = CMP-007-000048-3: Board Connector, 2 Contact(s), 1 Row(s), Male, Straight, 0.1 inch Pitch, Solder Terminal, Black Insulator, Receptacle; MIL Conformance: No; Contact Pattern: RECTANGULAR; Body Breadth: 0.092inch; Dielectric Withstanding Voltage (AC): 750V; Plating Thickness: 100uin; Reliability: COMMERCIAL; Option: General Purpose; Body Depth: 0.09inch; Number of Contacts: 2; Reference Standard: UL; Number Of PCB Rows: 1; Contact Style: SQ PIN-SKT; Mating Information: MULTIPLE MATING PARTS AVAILABLE; Body Length: 0.184inch; Rated Current (Signal): 3A; Insulation Resistance: 5GR; Min Operating Temperature: -65°C; Termination: Solder; Source: Components - 16.09.22 - 20.27.SchLib; RoHS Compliant: No; Filter Feature: No; Insulation Color: Black; Contact Finish - Mating: NOT SPECIFIED; Connector Type: BOARD CONNECTOR; Contact Material: Bronze; Design Item ID: CMP-002-00006-7; Flammability Rating: UL94 V-0; JESD-609 Code: e0; REACH SVHC: No SVHC; Max Operating Temperature: 105°C; Insulation Material: Thermoplastic; Mixed Contacts: No; Number Of Connectors: 1; Number of Rows Loaded: 1; Mount: Board; Body/Shell Style: RECEPTACLE; IEC Conformance: No; Terminal Pitch: 2.54mm; Mating Contact Pitch: 0.1inch; Terminal Length: 0.12inch; Contact Gender: Male; Contact Finish - Termination: TIN LEAD OVER NICKEL; Mounting Style: STRAIGHT; DIN Conformance: No; PCB Contact Pattern: RECTANGULAR
MD? = CMP-06331-000058-1: BLUETOOTH AUDIO MODULE

## Sheet DAC.SchDoc
size 279 x 215 mm; SheetNumber: 4; SheetTotal: 6; SPICEModelCacheRUGZJIPY: <root> / <DocumentId>RUGZJIPY</DocumentId> / <CacheFrame Number="0"> / <Model Name="cap" Kind="MDL"> / <Text>*Default semiconductor capacitor / .MODEL CAP C()</Text> / </Model> / </CacheFrame> / </root>
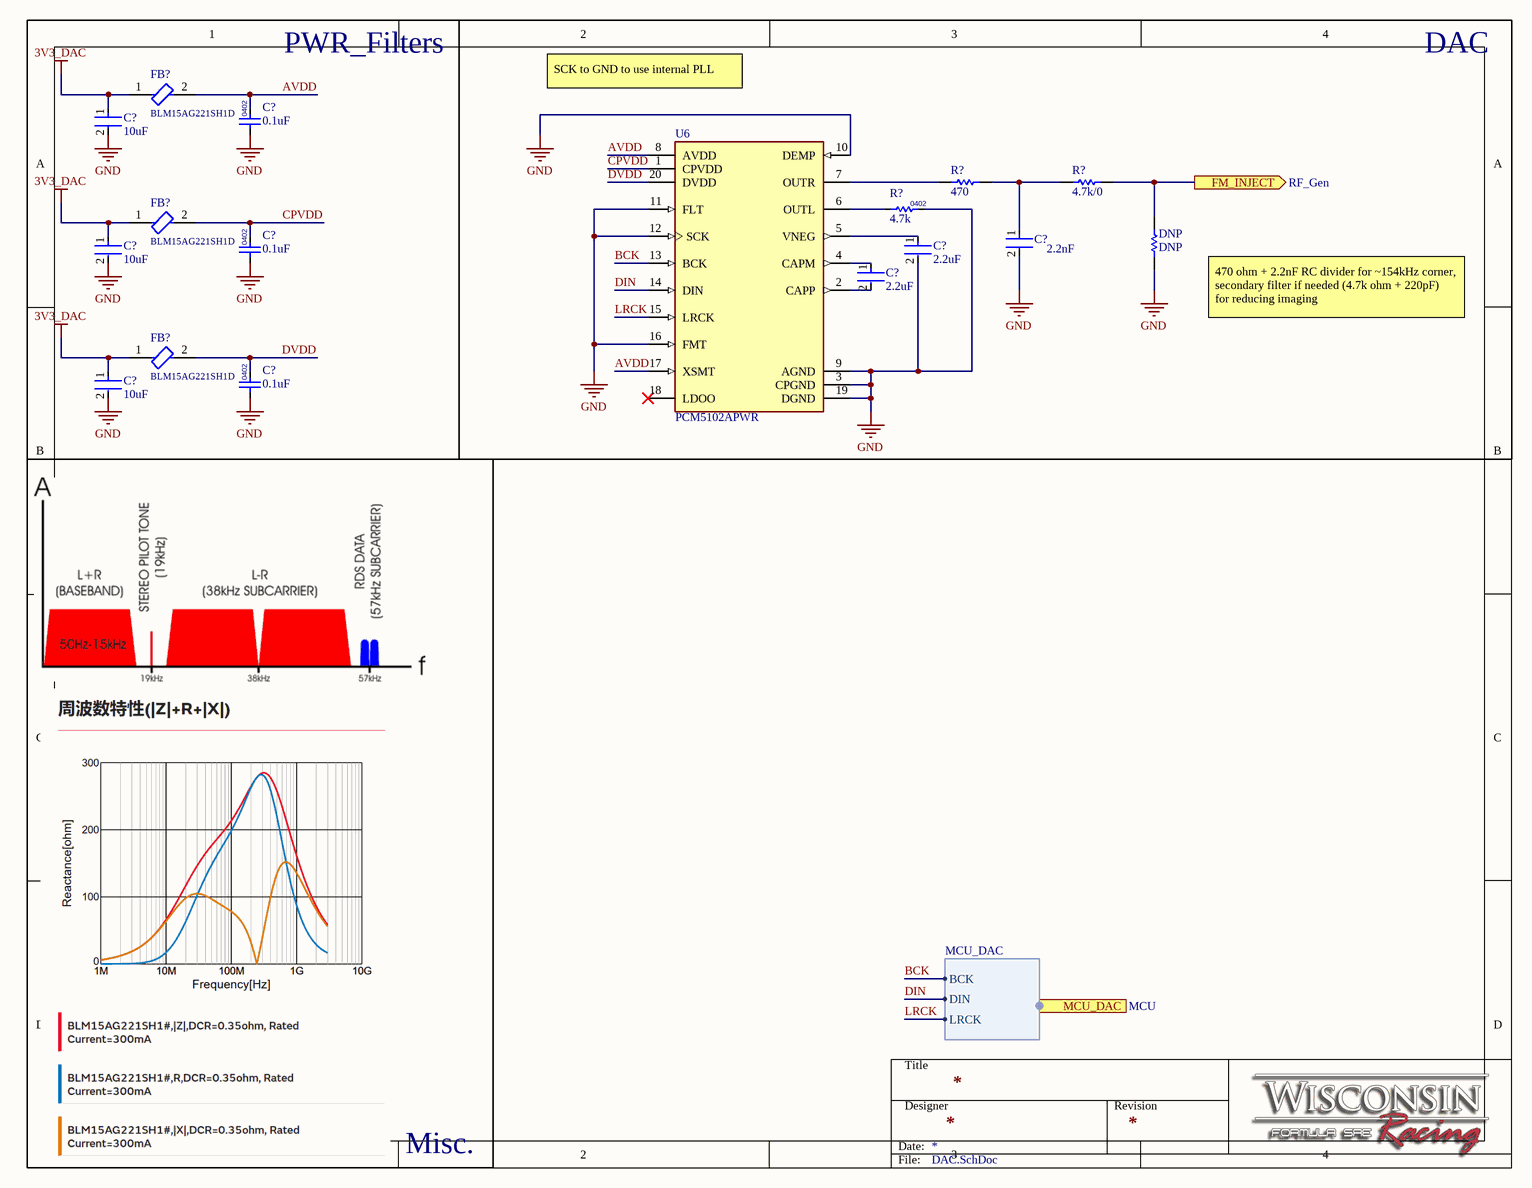
[diagram p3: DAC.SchDoc]

### Parts
(Parts that share a designator on the sheet are numbered #1, #2 ... from top to bottom, then left to right.)
C?#2  10uF  [FP-GRM155-0_2-IPC_A]
C?#3  0.1uF  [FP-CC0402-IPC_B]
C?#4  2.2nF  [FP-GRM155-0_05-IPC_C]
C?#5  10uF  [FP-GRM155-0_2-IPC_A]
C?#6  2.2uF  [FP-GRM155-0_2-IPC_B]
C?#7  0.1uF  [FP-CC0402-IPC_B]
C?#8  2.2uF  [FP-GRM155-0_2-IPC_B]
C?#9  10uF  [FP-GRM155-0_2-IPC_A]
C?#10  0.1uF  [FP-CC0402-IPC_B]
DNP#2  DNP  [RESC1005X40X25NL05T10]
FB?#1  BLM15AG221SH1D  [FP-BLM15-0_05-MFG]
FB?#2  BLM15AG221SH1D  [FP-BLM15-0_05-MFG]
FB?#3  BLM15AG221SH1D  [FP-BLM15-0_05-MFG]
R?#4  470  [RESC1005X40X25ML05T10]
R?#5  4.7k/0  [RESC1005X40X25NL05T10]
R?#6  value 4.7k  [RESC1005X40X25NL05T10]  (hidden comment: 4.7k 1%)
U6  PCM5102APWR  [FP-PW0020A-IPC_A]

### Blocks framed on the sheet
PWR_Filters: C?#2 C?#3 C?#5 C?#7 C?#9 C?#10 FB?#1-FB?#3
DAC: C?#4 C?#6 C?#8 DNP#2 R?#4-R?#6 U6

### Ports
FM_INJECT (out, see RF_Gen), MCU_DAC (harness MCU_DAC, see MCU)

### Harnesses
MCU_DAC: BCK, DIN, LRCK

### Nets
3V3_DAC: C?#2.1 C?#5.1 C?#9.1 FB?#1.1 FB?#2.1 FB?#3.1
GND: C?#2.2 C?#3.1 C?#4.2 C?#5.2 C?#6.2 C?#7.1 C?#9.2 C?#10.1 DNP#2.1 R?#6.2 U6.3(CPGND) U6.9(AGND) U6.10(DEMP) U6.11(FLT) U6.12(SCK) U6.16(FMT) U6.19(DGND)
AVDD: C?#3.2 FB?#1.2 U6.8(AVDD) U6.17(XSMT)
BCK: U6.13(BCK) ; port MCU_DAC.BCK
CPVDD: C?#7.2 FB?#2.2 U6.1(CPVDD)
DIN: U6.14(DIN) ; port MCU_DAC.DIN
DVDD: C?#10.2 FB?#3.2 U6.20(DVDD)
LRCK: U6.15(LRCK) ; port MCU_DAC.LRCK
NetC?#4_1: C?#4.1 R?#4.2 R?#5.1
NetC?#6_1: C?#6.1 U6.5(VNEG)
NetC?#8_1: C?#8.1 U6.4(CAPM)
NetC?#8_2: C?#8.2 U6.2(CAPP)
NetDNP#2_2: DNP#2.2 R?#5.2 ; port FM_INJECT
NetR?#4_1: R?#4.1 U6.7(OUTR)
NetR?#6_1: R?#6.1 U6.6(OUTL)

Not connected (* = marked no-connect by the designer): U6 18(LDOO)*

### Notes on the sheet
- SCK to GND to use internal PLL
- 470 ohm + 2.2nF RC divider for ~154kHz corner, secondary filter if needed (4.7k ohm + 220pF)  for reducing imaging
- Misc.
- Title
- Designer
- Revision
- Date:
- File:
- (in symbol CMP-Cap-00006-1) 0402

### Library data of the parts
C?#2 C?#5 C?#9 = CMP-06035-061139-1: as C33 on sheet PDU
C?#3 C?#7 C?#10 = CMP-Cap-00006-1: as C10 on sheet RF_Gen; Tolerance: 10%; Voltage Rating: 16V
C?#4 = CMP-06035-062041-1: Chip Multilayer Ceramic Capacitors for General Purpose, 0402, 2200pF, C0G, 30ppm/°C, 5%, 50V
C?#6 C?#8 = CMP-06035-003072-1: Chip Multilayer Ceramic Capacitors for General Purpose, 0402, 2.2uF, X7R, 15%, 10%, 10V; Case/Package: 0402
DNP#2 R?#5 = CMP-1011-00001-2: as DNP#1 on sheet RF_Gen
FB?#1-FB?#3 = CMP-06046-002173-1: Chip Ferrite Bead, 0402, 220Ω @ 100MHz, 0.35Ω, 25%, 300mA; Impedance: 220R; Number of Lines: 1; DC Resistance (DCR): 350mR; Package Quantity: 10000; Max Operating Temperature: 125°C; Case Code (Imperial): 0402; Ratings: AEC-Q200; Packaging: Tape and Reel; Width: 0.5mm; Core Material: Ferrite; Length: 0.039inch; Max Current Rating: 300mA; REACH SVHC: No SVHC; Weight: 2.3E-05oz; Height: 0.022inch; Max DC Current: 300mA; Series: EMIFIL®, BLM15A_SH; Test Frequency: 100MHz; Min Operating Temperature: -55°C; Termination: SMD/SMT; Mount: Surface Mount; Case Code (Metric): 1005; Depth: 0.55mm; Case/Package: 0402; RoHS Compliant: Yes; Tolerance: 25%; Number of Circuits: 1
R?#4 = CMP-2002-07697-1: Part Number: RC0402FR-07470RL; Manufacturer: Yageo / Phycomp
R?#6 = CMP-00178-1: Res General Purpose Thick Film 0402 4.7K Ohm 1% 1/16W ±100ppm/°C Molded SMD Paper T/R; Power Rating: 63mW; Voltage Rating (AC): 50V; Power Dissipation: 62.5mW; REACH SVHC: Yes; Harmonized Tariff Schedule (HTS) Code: 8533.21.00.30; Composition: Thick Film; Max Operating Temperature: 155°C; Number of Terminals: 2; Min Operating Temperature: -55°C; Depth: 500µm; Introduction Date: 2008-07-18; Case Code (Metric): 1005; Pins: 2; Packaging: Tape & Reel; Height: 350µm; China RoHS: Non-Compliant; Lead Free: Lead Free; Termination: SMD/SMT; Tolerance: 1%; Schedule B: 8533210045, 8533210045; Length: 1mm; Lifecycle Status: Production; Case Code (Imperial): 0402; RoHS: Compliant; Width: 500µm; Mounting Technology: Surface Mount; Temperature Coefficient: 100ppm/°C; Export Control Classification Number (ECCN) Code: EAR99; Country of Origin: Mainland China, Taiwan; Working Voltage: 50V; Voltage Rating: 50V; Case/Package: 0402; Voltage Rating (DC): 50V; Military Standard: Not
U6 = CMP-04861-000013-1: IC DAC 16/24/32BIT 384K 20TSSOP; Power Consumption: 59.4mW; Number of Analog Inputs: 0; Supply Type: Analog; Resolution: 32b; Number of Analog Outputs: 2; Max Power Dissipation: 187mW; Sampling Rate: 384KS/s; Operating Supply Voltage: 3.3V; Number of Bits: 32; Max Supply Voltage: 3.6V; Interface: Serial; Polarity: Unipolar; Min Supply Voltage: 3V; Output Type: Voltage; Signal to Noise Ratio (SNR): 112dB; Contact Plating: Gold; Package Quantity: 2000; Number of Pins: 20; Max Operating Temperature: 85°C; Series: DirectPath™; Case/Package: TSSOP; Conversion Rate: 384KS/s; Number of DAC Channels: 2; Mount: Surface Mount; REACH SVHC: No SVHC; Packaging: Tape and Reel; Number of Converters: 2; Min Operating Temperature: -25°C; Lead Free: Lead Free

## Sheet MCU.SchDoc
size 279 x 215 mm; SheetNumber: 5; SheetTotal: 6; SPICEModelCacheLZXJEGGY: <root> / <DocumentId>LZXJEGGY</DocumentId> / <CacheFrame Number="0"> / <Model Name="cap" Kind="MDL"> / <Text>*Default semiconductor capacitor / .MODEL CAP C()</Text> / </Model> / </CacheFrame> / </root>
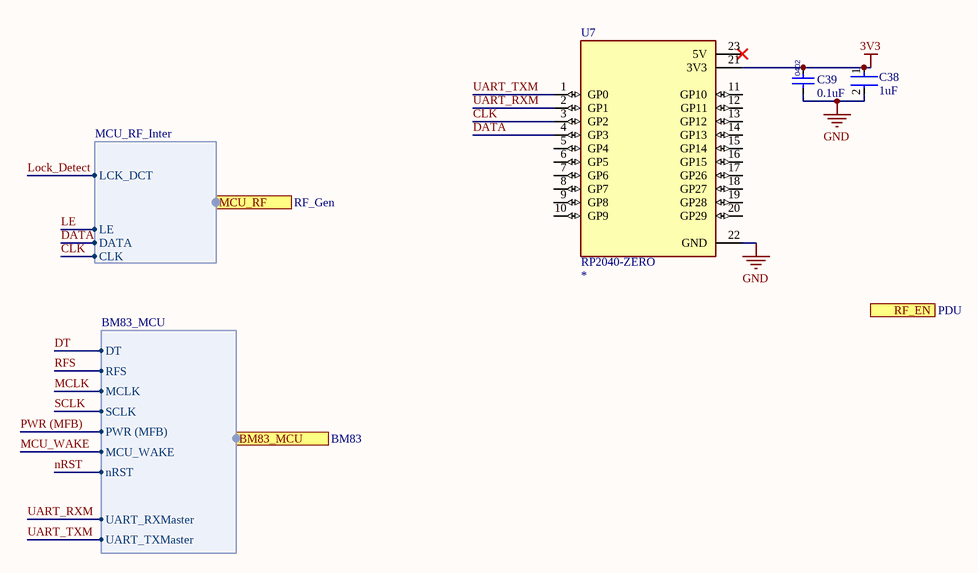
[diagram p4: MCU.SchDoc]

### Parts
C38  1uF  [FP-GRM155-0_1-IPC_C]
C39  0.1uF  [FP-CC0402-IPC_B]
U7  RP2040-ZERO  [MODULE_RP2040-ZERO]

### Ports
BM83_MCU (harness BM83_MCU, see BM83), MCU_RF (harness MCU_RF_Inter, see RF_Gen), RF_EN (in, see PDU)

### Harnesses
BM83_MCU: MCLK, MCU_WAKE, SCLK, PWR (MFB), RFS, DT, nRST, UART_TXMaster, UART_RXMaster
MCU_RF_Inter: LCK_DCT, LE, DATA, CLK

### Nets
3V3: C38.1 C39.2 U7.21(3V3)
GND: C38.2 C39.1 U7.22(GND)
CLK: U7.3(GP2) ; port MCU_RF.CLK
DATA: U7.4(GP3) ; port MCU_RF.DATA
UART_RXM: U7.2(GP1) ; port BM83_MCU.UART_RXMaster
UART_TXM: U7.1(GP0) ; port BM83_MCU.UART_TXMaster

Not connected (* = marked no-connect by the designer): U7 5(GP4) 6(GP5) 7(GP6) 8(GP7) 9(GP8) 10(GP9) 11(GP10) 12(GP11) 13(GP12) 14(GP13) 15(GP14) 16(GP15) 17(GP26) 18(GP27) 19(GP28) 20(GP29) 23(5V)*

### Notes on the sheet
- Title
- Designer
- Revision
- Date:
- File:
- (in symbol CMP-Cap-00006-1) 0402

### Library data of the parts
C38 = CMP-06035-028020-1: as C27 on sheet PDU
C39 = CMP-Cap-00006-1: as C10 on sheet RF_Gen; Tolerance: 10%; Voltage Rating: 16V
U7 = CMP-202-000000-1: Low-Cost, High-Performance Pico-Like MCU Board Based On Raspberry Pi Microcontroller RP2040; MF: Waveshare Electronics; Component Type: Standard; Source: RP2040-ZERO.SchLib; SnapEDA_Link: https://www.snapeda.com/parts/RP2040-ZERO/Waveshare+Electronics/view-part/?ref=snap; Value: *; Package: Package; Design Item ID: RP2040-ZERO; Check_prices: https://www.snapeda.com/parts/RP2040-ZERO/Waveshare+Electronics/view-part/?ref=eda; Pin Count: 23; MP: RP2040-ZERO

## Sheet RF_Bypass.SchDoc
size 279 x 215 mm; SheetNumber: 6; SheetTotal: 6
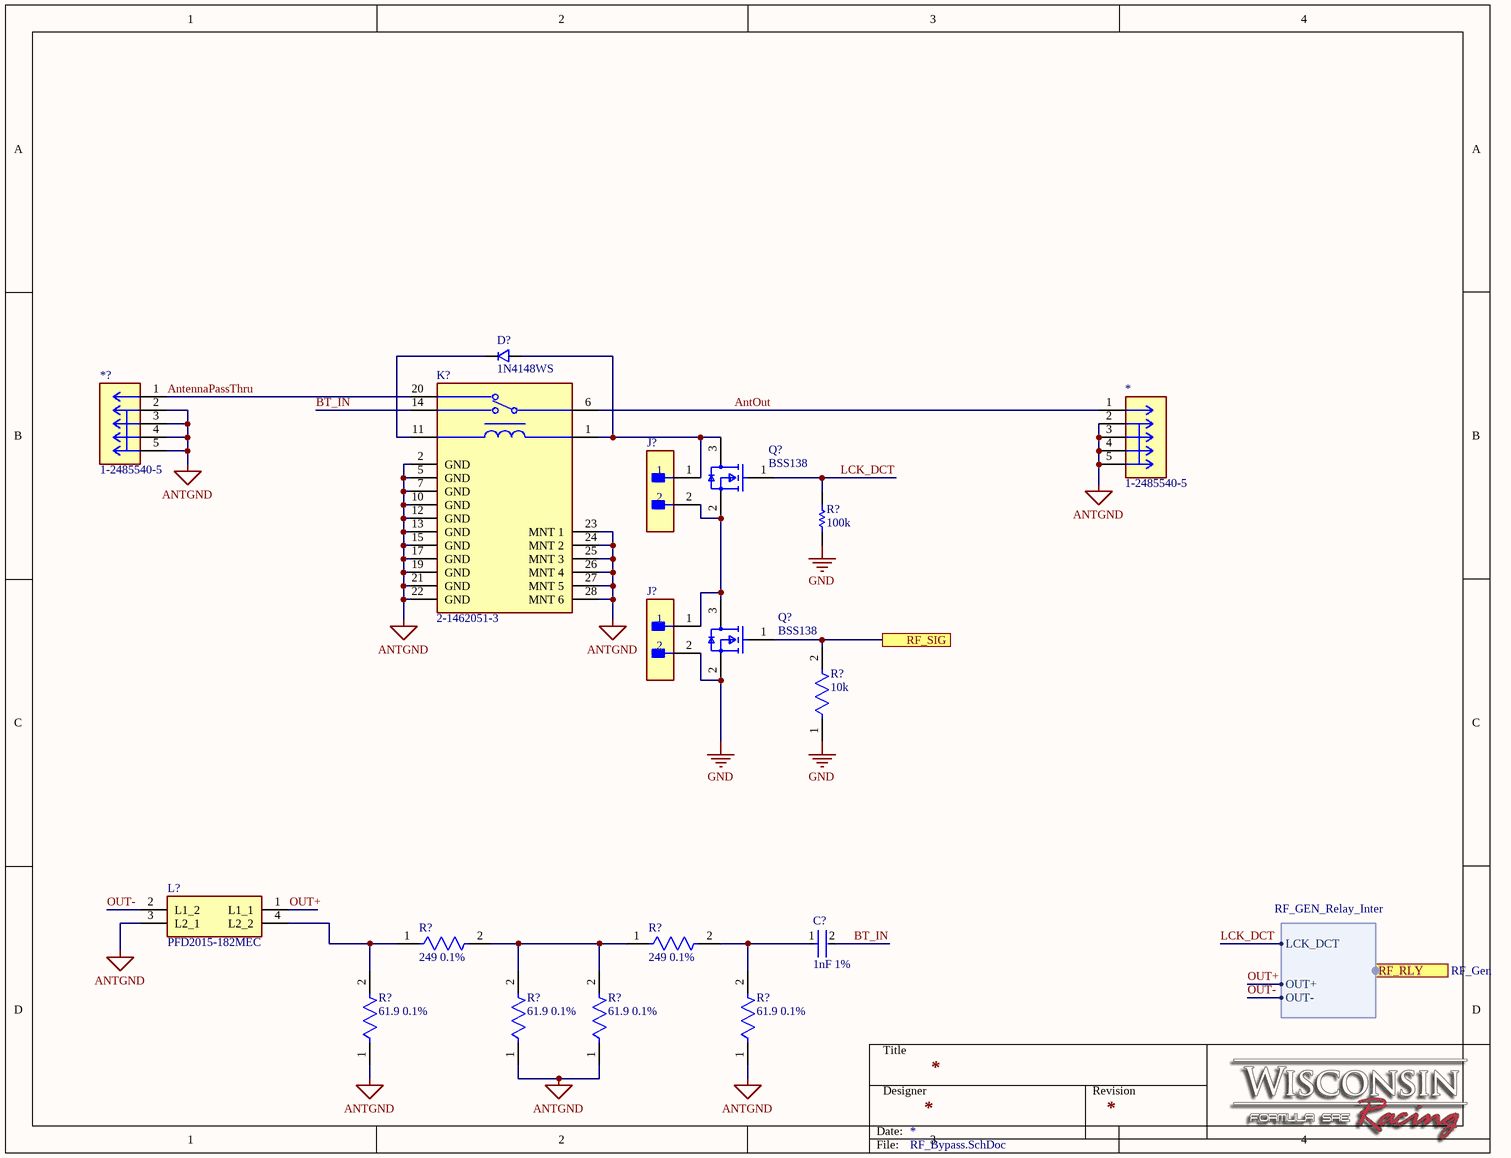
[diagram p5: RF_Bypass.SchDoc]

### Parts
(Parts that share a designator on the sheet are numbered #1, #2 ... from top to bottom, then left to right.)
*  1-2485540-5  [1-2485540-5-Footprint-1]
*?  1-2485540-5  [1-2485540-5-Footprint-1]
C?#11  1nF 1%  [FP-GRT155-0_05-IPC_A]
D?  1N4148WS  [SODFL250X90-2N]
J?#4  TSM-102-01-T-SV-TR  [FP-TSM-102-01-T-SV-TR-MFG]  (value not drawn)
J?#5  TSM-102-01-T-SV-TR  [FP-TSM-102-01-T-SV-TR-MFG]  (value not drawn)
K?  2-1462051-3  [FP-2-1462051-3-MFG]
L?  PFD2015-182MEC  [PFD2015102MEB]
Q?#1  BSS138  [FP-318-08-IPC_B]
Q?#2  BSS138  [FP-318-08-IPC_B]
R?#7  100k  [RESC1005X40X25NL05T10]
R?#8  10k  [FP-RC0402-0_4-IPC_C]
R?#9  249 0.1%  [FP-RT0402-MFG]
R?#10  249 0.1%  [FP-RT0402-MFG]
R?#11  61.9 0.1%  [FP-RP73P-1E-MFG]
R?#12  61.9 0.1%  [FP-RP73P-1E-MFG]
R?#13  61.9 0.1%  [FP-RP73P-1E-MFG]
R?#14  61.9 0.1%  [FP-RP73P-1E-MFG]

### Ports
RF_RLY (harness RF_GEN_Relay_Inter, see RF_Gen), RF_SIG

### Harnesses
RF_GEN_Relay_Inter: LCK_DCT, OUT+, OUT-

### Nets
ANTGND: *.2 *.3 *.4 *.5 *?.2 *?.3 *?.4 *?.5 K?.2(GND) K?.5(GND) K?.7(GND) K?.10(GND) K?.12(GND) K?.13(GND) K?.15(GND) K?.17(GND) K?.19(GND) K?.21(GND) K?.22(GND) K?.23(MNT_1) K?.24(MNT_2) K?.25(MNT_3) K?.26(MNT_4) K?.27(MNT_5) K?.28(MNT_6) L?.3(L2_1) R?#11.1 R?#12.1 R?#13.1 R?#14.1
GND: J?#5.2 Q?#2.2(S) R?#7.1 R?#8.1
AntennaPassThru: *?.1 K?.20
AntOut: *.1 K?.6
BT_IN: C?#11.2 K?.14
LCK_DCT: Q?#1.1(G) R?#7.2 ; port RF_RLY.LCK_DCT
OUT-: L?.2(L1_2) ; port RF_RLY.OUT-
NetC?#11_1: C?#11.1 R?#10.2 R?#14.2
NetD?_1: D?.1 K?.11(-)
NetD?_2: D?.2 J?#4.1 K?.1(+) Q?#1.3(D)
NetJ?#4_2: J?#4.2 J?#5.1 Q?#1.2(S) Q?#2.3(D)
NetL?_4: L?.4(L2_2) R?#9.1 R?#11.2
NetQ?#2_1: Q?#2.1(G) R?#8.2 ; port RF_SIG
NetR?#9_2: R?#9.2 R?#10.1 R?#12.2 R?#13.2

Not connected (* = marked no-connect by the designer): L? 1(L1_1)

### Notes on the sheet
- Labels drawn without touching a wire or pin: OUT+
- Title
- Designer
- Revision
- Date:
- File:

### Library data of the parts
* *? = CMP-00172-1: FAKRA Connector, Plug, 50 ohm, Locking, 6 GHz, Cable-to-Board, 1 Position, Printed Circuit Board, -40 – 105 °C [-40 – 221 °F], Solder, FAKRA
C?#11 = CMP-06035-012909-1: as C1 on sheet RF_Gen
D? = CMP-REC-0001-6: Diode
J?#4 J?#5 = CMP-02766-000113-1: CONN HEADER SMD 2POS 2.54MM; Gender: Male; Max Voltage Rating (AC): 475V; Number of Contacts: 2; Max Current Rating: 7A; Contact Material: Bronze; Min Operating Temperature: -55°C; REACH SVHC: No SVHC; Housing Material: Polymer; Lead Free: Lead Free; Orientation: Straight; Radiation Hardening: No; Number of Rows: 1; Length: 5.08mm; Housing Color: Black; Max Operating Temperature: 105°C; Contact Plating: Tin; Depth: 2.54mm; Packaging: Tape and Reel; Pitch: 2.54mm; Termination: Solder
K? = CMP-03396-000136-1: RELAY RF SPDT 2A 5V; Max Voltage Rating (AC): 250V; Contact Voltage Rating (DC): 220V; Operate Time: 3ms; Actuating System: DC; Release Time: 5ms; Coil Resistance: 178R; Coil Current: 28.1mA; Insertion Loss: -0.3dB; Coil Power: 140mW; Coil Type: Non-Latching; Contact Current Rating: 2A; Radiation Hardening: No; Voltage Rating (AC): 250V; ELV: Compliant; Max Voltage Rating (DC): 220V; Min Operating Temperature: -55°C; Coil Voltage (DC): 5V; Number of Pins: 22; Max Current Rating: 2A; Height: 10.5mm; Package Quantity: 250; Termination: PCB; Length: 14.9inch; RoHS Compliant: No; Packaging: Box; Width: 0.295inch; Depth: 9.4mm; Relay Type: Relay; Mount: Surface Mount; Throw Configuration: SPDT; Contact Plating: Gold; Contact Material: Nickel; Weight: 3oz; Series: HF3S, AXICOM; Max Operating Temperature: 85°C
L? = PFD2015-102MEB: Inductor; Manufacturer_Name: COILCRAFT; Datasheet Link: https://www.coilcraft.com/pdfs/pfd2015_flyback.pdf; Height: 1.5mm; Manufacturer_Part_Number: PFD2015-102MEB; Mouser Part Number: 994-PFD2015-102MEB; Mouser Price/Stock: https://www.mouser.com/Search/Refine.aspx?Keyword=994-PFD2015-102MEB
Q?#1 Q?#2 = CMP-07173-000101-1: as Q2 on sheet PDU; Lead Free: Lead Free; Length: 2.92mm; Width: 1.3mm; Drain to Source Breakdown Voltage: 50V; Min Operating Temperature: -55°C; REACH SVHC: No SVHC; Packaging: Tape and Reel; Radiation Hardening: No; Height: 0.93mm; Drain to Source Voltage (Vdss): 50V; Current Rating: 220mA; Voltage Rating (DC): 50V; Weight: 0.03g; Continuous Drain Current (ID): 220mA; Number of Pins: 3; Nominal Vgs: 1.3V; Max Power Dissipation: 360mW; Fall Time: 9ns; Drain to Source Resistance: 3.5R; Contact Plating: Tin; Case/Package: SOT-23; Package Quantity: 1; Dual Supply Voltage: 50V; Mount: Surface Mount; Termination: SMD/SMT; Max Operating Temperature: 150°C
R?#7 = CMP-2002-07343-1: as R17 on sheet PDU
R?#8 = CMP-2002-07915-3: RES 10K OHM 5% 1/16W 0402; Max Power Dissipation: 63mW; Temperature Coefficient: 100ppm/°C; Power Rating: 62.5mW; Resistance: 10kR; Voltage Rating: 50V; Size Code: 0402; Resistance Tolerance: 5%; Packaging: Tape and Reel; Case Code (Metric): 1005; Lead Free: Lead Free; Resistor Type: Thick Film; Min Operating Temperature: -55°C; Military Standard: Not; Depth: 0.5mm; Series: RC; Case/Package: 0402; Construction: Rectangular; Number of Terminations: 2; Package Quantity: 1; Termination: SMD/SMT; Length: 0.039inch; Case Code (Imperial): 0402; Height: 0.016inch; Features: Moisture Resistant; RoHS Compliant: Yes; Max Operating Temperature: 155°C; Tolerance: 5%; Width: 0.02inch
R?#9 R?#10 = CMP-2002-02712-2: RES SMD 249 OHM 0.1% 1/16W 0402; Manufacturer: Yageo; Manufacturer Part Number: RT0402BRD07249RL; Temperature Coefficient: 25 ppm/°C; Power Rating: 0.063W; Description: RT0402 249Ω 0.063W 25 ppm/°C 0.10%; Value: 249Ω; Voltage Rating: 50V; Tolerance: 0.001; Footprint Url: http://www.yageo.com/exep/pages/download/literatures/PYu-R_Mount_10.pdf; Device Class L3: Chip SMD Resistors; Category: Res; Resistance: 249Ω; Device Class L2: Resistors; Height: 0.35mm; Device Class L1: Passive Components; Package: RT0402; Ipc Land Pattern Name: RESC10050X30; Temperature Range Low: -55°C; Lead Free: Yes; ComponentLink2Description: Datasheet; Octopart: https://octopart.com/rt0402brd07249rl-yageo-1467928; Digikey Description: RES SMD 249 OHM 0.1% 1/16W 0402; Automotive: No; Composition: Thin Film; Temperature: -55°C to +155°C; RoHS: TRUE; Temperature Range High: +155°C; Series: RT; Mouser Description: Thin Film Resistors - SMD 1/16W 249 ohm .1% 25ppm; ComponentLink2URL: http://www.yageo.com/documents/recent/PYu-RT_1-to-0.01_RoHS_L_9.pdf
R?#11-R?#14 = CMP-03211-009150-1: RP73P 0402 61.9Ω 0.1W 25ppm/°C 0.10% 50V; Manufacturer: TE Connectivity; Manufacturer Part Number: RP73PF1E61R9BTD; Temperature Coefficient: 25ppm/°C; Temperature: -55°C to +155°C; Voltage Rating: 50V; Composition: Thin Film; Value: 61.9Ω; Ipc Land Pattern Name: RESC10050X30; Device Class L3: Chip SMD Resistors; Resistance: 61.9Ω; Octopart: https://octopart.com/rp73pf1e61r9btd-te+connectivity-89230235; ComponentLink2URL: https://www.te.com/commerce/DocumentDelivery/DDEController?Action=srchrtrv&DocNm=1773272&DocType=DS&DocLang=English; RoHS: TRUE; Device Class L2: Resistors; Series: RP73P; Temperature Range Low: -55°C; Category: Res; ComponentLink2Description: Datasheet; Temperature Range High: +155°C; Height: 0.35mm; Lead Free: Yes; Automotive: No; Power Rating: 0.1W; Package: RP73P-1E; Device Class L1: Passive Components; Tolerance: 0.10%

## Nets that join several sheets
3V3: PDU (6 pins), BM83 (C?#1.2 J?#1.8 MD?.23), MCU (C38.1 C39.2 U7.21)
3V3_DAC: PDU (C31.1 R25.2 U4.1), DAC (6 pins)
3V3_RF: RF_Gen (16 pins), PDU (C35.1 R29.2 U5.1)
CP_PWR: RF_Gen (6 pins), PDU (6 pins)
GND: RF_Gen (27 pins), PDU (42 pins), BM83 (11 pins), DAC (17 pins), MCU (C38.2 C39.1 U7.22), RF_Bypass (J?#5.2 Q?#2.2 R?#7.1 R?#8.1)
CLK: RF_Gen (U1.12), MCU (U7.3)
DATA: RF_Gen (U1.13), MCU (U7.4)
LCK_DCT: RF_Gen (R?#3.2), RF_Bypass (Q?#1.1 R?#7.2)
OUT-: RF_Gen (C4.2), RF_Bypass (L?.2)
UART_RXM: BM83 (MD?.30), MCU (U7.2)
UART_TXM: BM83 (MD?.29), MCU (U7.1)